# Altium schematic sheet Coil Board - Heirarchy.SchDoc: Heirarchy
size B
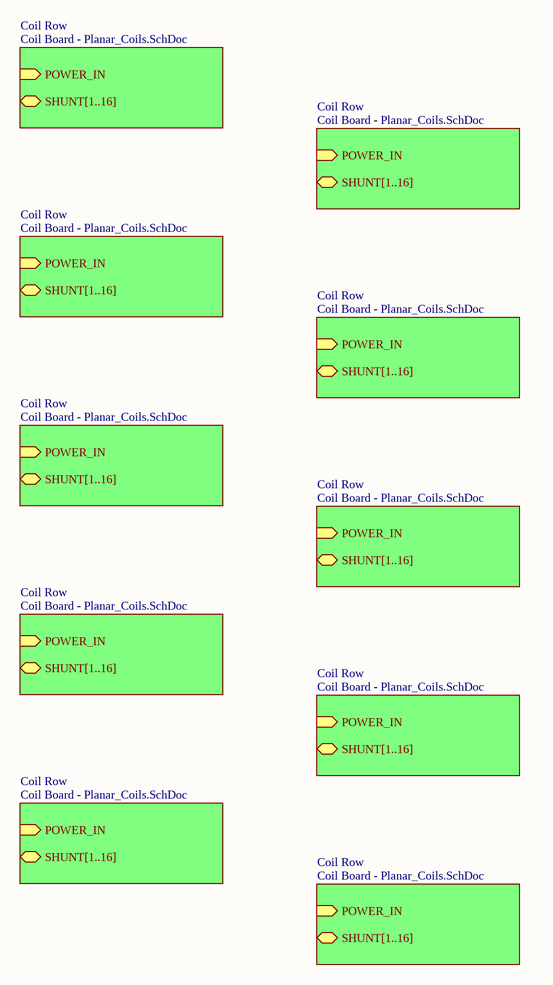
[diagram p0: Coil Board - Heirarchy.SchDoc]

## Sub-sheets
Coil Row = Coil Board - Planar_Coils.SchDoc: SHUNT[1..16] (bidir), POWER_IN (in)
Coil Row = Coil Board - Planar_Coils.SchDoc: SHUNT[1..16] (bidir), POWER_IN (in)
Coil Row = Coil Board - Planar_Coils.SchDoc: SHUNT[1..16] (bidir), POWER_IN (in)
Coil Row = Coil Board - Planar_Coils.SchDoc: SHUNT[1..16] (bidir), POWER_IN (in)
Coil Row = Coil Board - Planar_Coils.SchDoc: SHUNT[1..16] (bidir), POWER_IN (in)
Coil Row = Coil Board - Planar_Coils.SchDoc: SHUNT[1..16] (bidir), POWER_IN (in)
Coil Row = Coil Board - Planar_Coils.SchDoc: SHUNT[1..16] (bidir), POWER_IN (in)
Coil Row = Coil Board - Planar_Coils.SchDoc: SHUNT[1..16] (bidir), POWER_IN (in)
Coil Row = Coil Board - Planar_Coils.SchDoc: SHUNT[1..16] (bidir), POWER_IN (in)
Coil Row = Coil Board - Planar_Coils.SchDoc: SHUNT[1..16] (bidir), POWER_IN (in)

## Notes on the sheet
- Title
- Size:
- Date:
- B
- Number:
- Time:
- Revision:
- Sheet
- of
- File: